# EAGLE design SSD1963_drier (EAGLE 6.1)
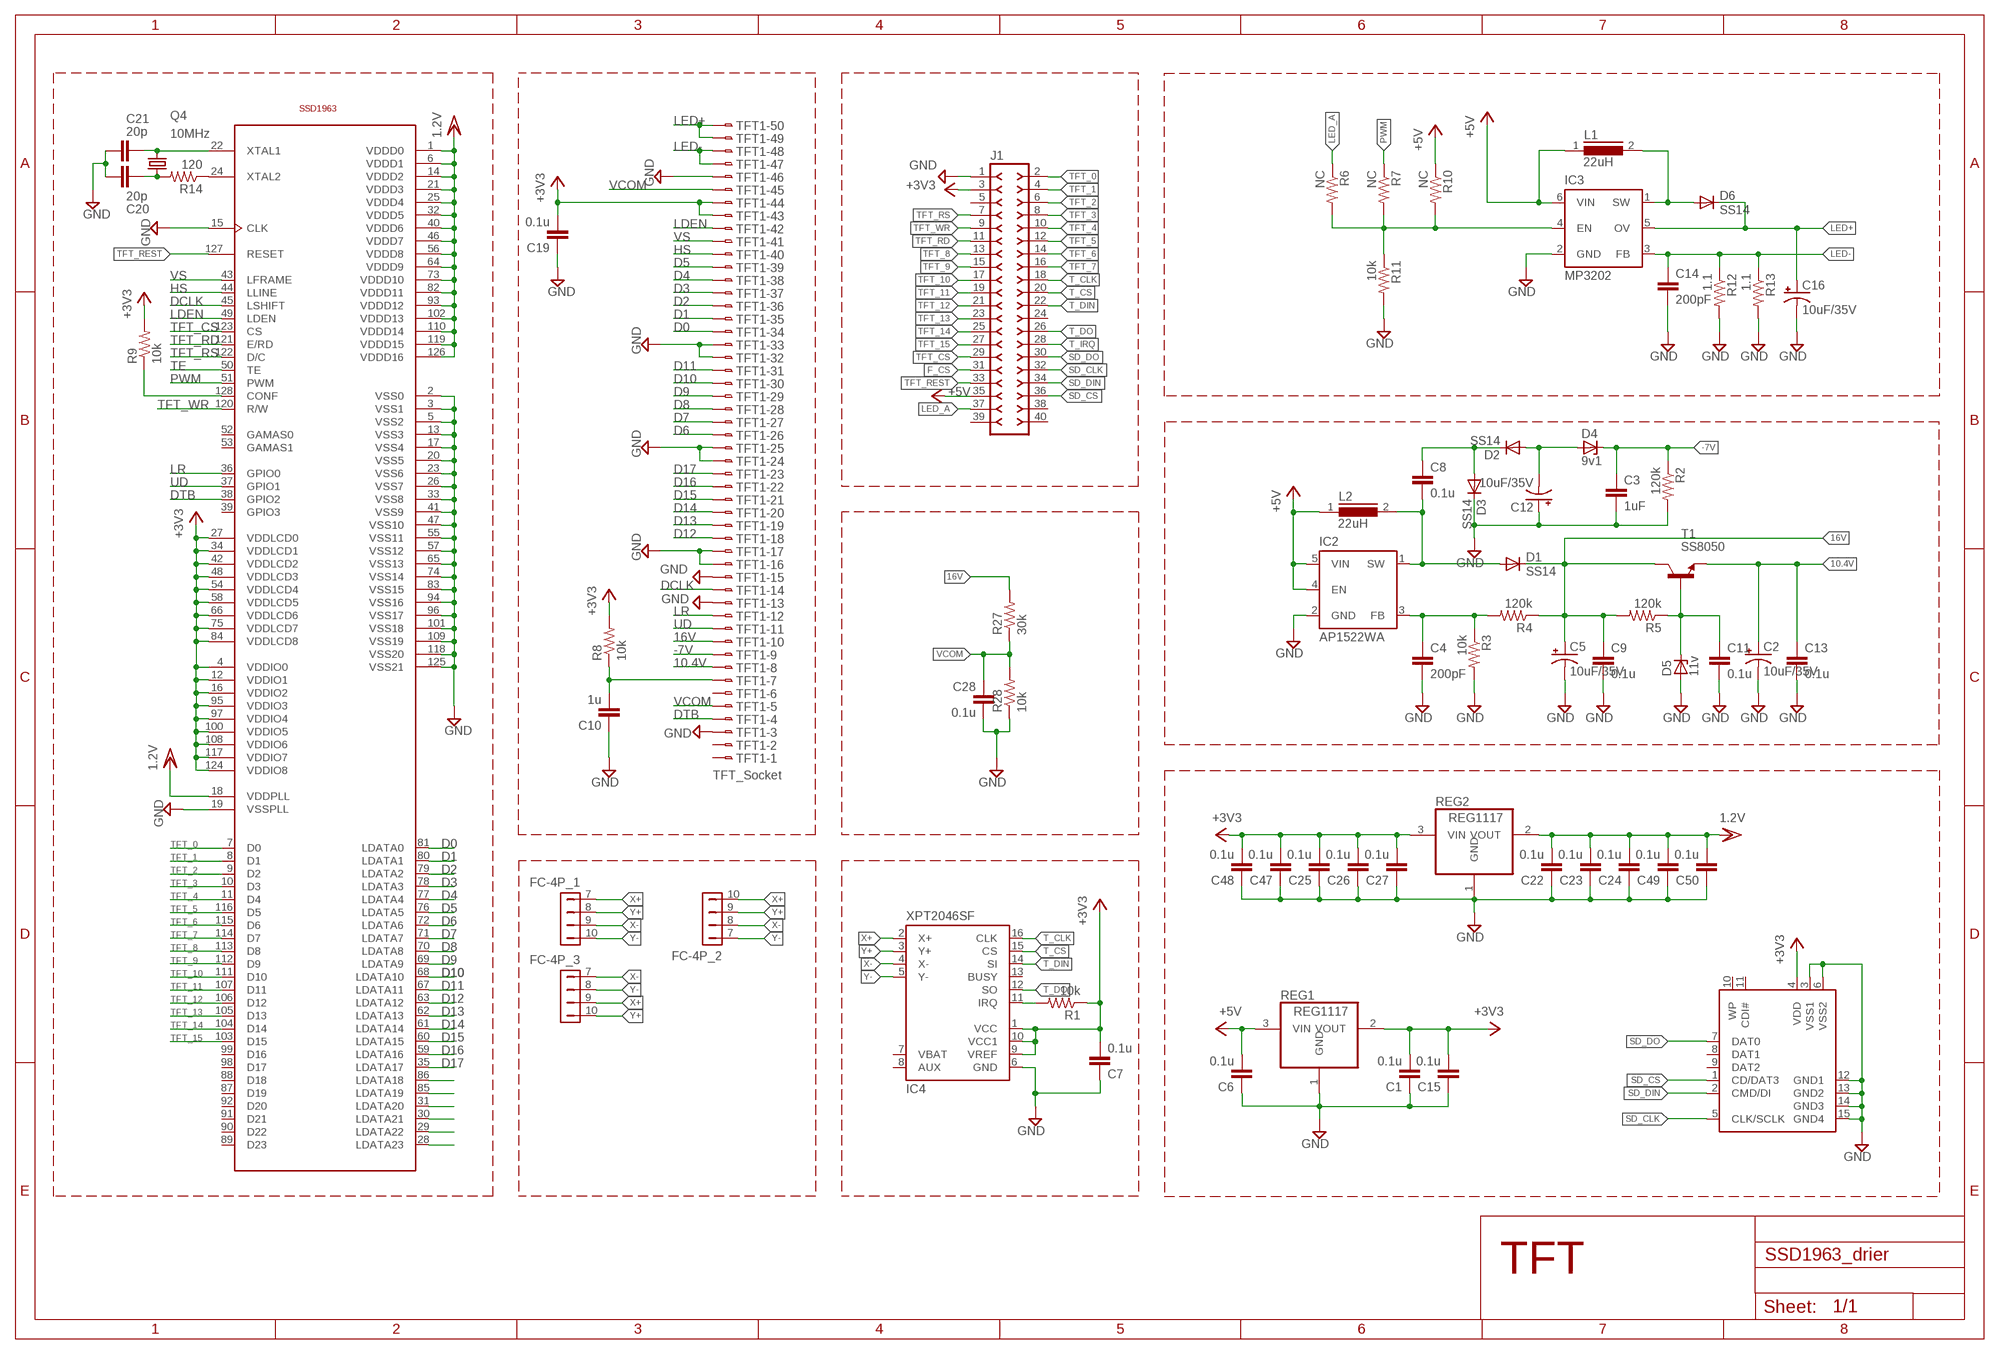
[diagram p0: schematic, sheet 1]

## Parts
C1  0.1u  C-EUC0805  [C0805]
C2  10uF/35V  CPOL-USB/3528-21R  [B/3528-21R]
C3  1uF  C-EUC0805  [C0805]
C4  200pF  C-EUC0805  [C0805]
C5  10uF/35V  CPOL-USB/3528-21R  [B/3528-21R]
C6  0.1u  C-EUC0805  [C0805]
C7  0.1u  C-EUC0805  [C0805]
C8  0.1u  C-EUC0805  [C0805]
C9  0.1u  C-EUC0805  [C0805]
C10  1u  C-EUC0805  [C0805]
C11  0.1u  C-EUC0805  [C0805]
C12  10uF/35V  CPOL-USB/3528-21R  [B/3528-21R]
C13  0.1u  C-EUC0805  [C0805]
C14  200pF  C-EUC0805  [C0805]
C15  0.1u  C-EUC0805  [C0805]
C16  10uF/35V  CPOL-USB/3528-21R  [B/3528-21R]
C19  0.1u  C-EUC0805  [C0805]
C20  20p  C-EUC0805  [C0805]
C21  20p  C-EUC0805  [C0805]
C22  0.1u  C-EUC0805  [C0805]
C23  0.1u  C-EUC0805  [C0805]
C24  0.1u  C-EUC0805  [C0805]
C25  0.1u  C-EUC0805  [C0805]
C26  0.1u  C-EUC0805  [C0805]
C27  0.1u  C-EUC0805  [C0805]
C28  0.1u  C-EUC0805  [C0805]
C47  0.1u  C-EUC0805  [C0805]
C48  0.1u  C-EUC0805  [C0805]
C49  0.1u  C-EUC0805  [C0805]
C50  0.1u  C-EUC0805  [C0805]
D1  SS14  DIODE-DO214AC  [DO214AC]
D2  SS14  DIODE-DO214AC  [DO214AC]
D3  SS14  DIODE-DO214AC  [DO214AC]
D4  9v1  ZENER-DIODESOD80C  [SOD80C]
D5  11v  ZENER-DIODESOD80C  [SOD80C]
D6  SS14  DIODE-DO214AC  [DO214AC]
FC-4P_1  FH12-04S-1S  [FH12-4S-1SH]
FC-4P_2  FH12-04S-1S  [FH12-4S-1SH]
FC-4P_3  FH12-04S-1S  [FH12-4S-1SH]
IC1  SSD1963LQFP  [LQFP128]
IC2  AP1522WA  [SOT23-5L]
IC3  MP3202  [SOT23-6L]
IC4  XPT2046SF  [TSSOP16L]
J1  F-2X20-SF-100  [SF-100-2X20]
L1  22uH  DR74  [DR74]
L2  22uH  DR74  [DR74]
Q4  10MHz  CRYSTALHC49UP  [HC49UP]
R1  10k  R-US_R0805  [R0805]
R2  120k  R-US_R0805  [R0805]
R3  10k  R-US_R0805  [R0805]
R4  120k  R-US_R0805  [R0805]
R5  120k  R-US_R0805  [R0805]
R6  NC  R-US_R0805  [R0805]
R7  NC  R-US_R0805  [R0805]
R8  10k  R-US_M0805  [M0805]
R9  10k  R-US_M0805  [M0805]
R10  NC  R-US_R0805  [R0805]
R11  10k  R-US_R0805  [R0805]
R12  1.1  R-US_R0805  [R0805]
R13  1.1  R-US_R0805  [R0805]
R14  120  R-US_M0805  [M0805]
R27  30k  R-US_M0805  [M0805]
R28  10k  R-US_M0805  [M0805]
REG1  REG1117  [SOT223]
REG2  REG1117  [SOT223]
SOC_1  MMC/SD  SDCARDVAR2  [SDCMF-10915W010]
T1  SS8050  BC847  [SOT23]
TFT1  TFT_Socket  FH28-50S-0.5SH(51)XL  [50]

## Nets
10.4V: C2.+ C13.1 T1.2(E) TFT1.8
16V: C5.+ C9.1 D1.C R4.1 R5.2 R27.2 T1.3(C) TFT1.10
+3V3: C1.2 C7.2 C15.2 C19.2 C25.2 C26.2 C27.2 C47.2 C48.2 IC1.4(VDDIO0) IC1.12(VDDIO1) IC1.16(VDDIO2) IC1.27(VDDLCD0) IC1.34(VDDLCD1) IC1.42(VDDLCD2) IC1.48(VDDLCD3) IC1.54(VDDLCD4) IC1.58(VDDLCD5) IC1.66(VDDLCD6) IC1.75(VDDLCD7) IC1.84(VDDLCD8) IC1.95(VDDIO3) IC1.97(VDDIO4) IC1.100(VDDIO5) IC1.108(VDDIO6) IC1.117(VDDIO7) IC1.124(VDDIO8) IC4.1(VCC) IC4.9(VREF) IC4.10(VCC1) J1.3 R1.1 R8.2 R9.2 REG1.2(VOUT) REG2.3(VIN) SOC_1.4(VDD) TFT1.43 TFT1.44
+5V: C6.2 IC2.4(EN) IC2.5(VIN) IC3.6(VIN) J1.35 L1.1 L2.1 R10.1 REG1.3(VIN)
-7V: C3.1 D4.C R2.1 TFT1.9
D0: IC1.81(LDATA0) TFT1.34
D1: IC1.80(LDATA1) TFT1.35
D2: IC1.79(LDATA2) TFT1.36
D3: IC1.78(LDATA3) TFT1.37
D4: IC1.77(LDATA4) TFT1.38
D5: IC1.76(LDATA5) TFT1.39
D6: IC1.72(LDATA6) TFT1.26
D7: IC1.71(LDATA7) TFT1.27
D8: IC1.70(LDATA8) TFT1.28
D9: IC1.69(LDATA9) TFT1.29
D10: IC1.68(LDATA10) TFT1.30
D11: IC1.67(LDATA11) TFT1.31
D12: IC1.63(LDATA12) TFT1.18
D13: IC1.62(LDATA13) TFT1.19
D14: IC1.61(LDATA14) TFT1.20
D15: IC1.60(LDATA15) TFT1.21
D16: IC1.59(LDATA16) TFT1.22
D17: IC1.35(LDATA17) TFT1.23
DCLK: IC1.45(LSHIFT) TFT1.14
DTB: IC1.38(GPIO2) TFT1.4
F_CS: J1.31
GND: C1.1 C2.- C3.2 C4.2 C5.- C6.1 C7.1 C9.2 C10.1 C11.2 C12.+ C13.2 C14.2 C15.1 C16.- C19.1 C20.1 C21.1 C22.1 C23.1 C24.1 C25.1 C26.1 C27.1 C28.2 C47.1 C48.1 C49.1 C50.1 D3.C D5.A IC1.2(VSS0) IC1.3(VSS1) IC1.5(VSS2) IC1.13(VSS3) IC1.15(CLK) IC1.17(VSS4) IC1.19(VSSPLL) IC1.20(VSS5) IC1.23(VSS6) IC1.26(VSS7) IC1.33(VSS8) IC1.41(VSS9) IC1.47(VSS10) IC1.55(VSS11) IC1.57(VSS12) IC1.65(VSS13) IC1.74(VSS14) IC1.83(VSS15) IC1.94(VSS16) IC1.96(VSS17) IC1.101(VSS18) IC1.109(VSS19) IC1.118(VSS20) IC1.125(VSS21) IC2.2(GND) IC3.2(GND) IC4.6(GND) J1.1 R2.2 R3.2 R11.2 R12.2 R13.2 R28.1 REG1.1(GND) REG2.1(GND) SOC_1.3(VSS1) SOC_1.6(VSS2) SOC_1.12(GND1) SOC_1.13(GND2) SOC_1.14(GND3) SOC_1.15(GND4) TFT1.3 TFT1.13 TFT1.15 TFT1.16 TFT1.17 TFT1.24 TFT1.25 TFT1.32 TFT1.33 TFT1.46
HS: IC1.44(LLINE) TFT1.40
LDEN: IC1.49(LDEN) TFT1.42
LED+: C16.+ D6.C IC3.5(OV) TFT1.49 TFT1.50
LED-: C14.1 IC3.3(FB) R12.1 R13.1 TFT1.47 TFT1.48
LED_A: J1.37 R6.1
LR: IC1.36(GPIO0) TFT1.12
N$2: C8.2 D1.A IC2.1(SW) L2.2
N$4: IC1.24(XTAL2) R14.1
N$7: C8.1 D2.C D3.A
N$8: C12.- D2.A D4.A
N$9: C4.1 IC2.3(FB) R3.1 R4.2
N$11: D6.A IC3.1(SW) L1.2
N$12: C11.1 D5.C R5.1 T1.1(B)
N$13: IC3.4(EN) R6.2 R7.2 R10.2 R11.1
N$15: C21.2 IC1.22(XTAL1) Q4.2
N$16: C20.2 Q4.1 R14.2
N$17: IC1.86(LDATA18)
N$19: IC1.85(LDATA19)
N$20: IC1.31(LDATA20)
N$21: IC1.30(LDATA21)
N$22: IC1.29(LDATA22)
N$23: IC1.28(LDATA23)
N$24: IC1.128(CONF) R9.1
N$28: C10.2 R8.1 TFT1.7
PWM: IC1.51(PWM) R7.1
SD_CLK: J1.32 SOC_1.5(CLK/SCLK)
SD_CS: J1.36 SOC_1.1(CD/DAT3)
SD_DIN: J1.34 SOC_1.2(CMD/DI)
SD_DO: J1.30 SOC_1.7(DAT0)
T_CLK: IC4.16(CLK) J1.18
T_CS: IC4.15(CS) J1.20
T_DIN: IC4.14(SI) J1.22
T_DO: IC4.12(SO) J1.26
T_IRQ: IC4.11(IRQ) J1.28 R1.2
TE: IC1.50(TE)
TFT_0: IC1.7(D0) J1.2
TFT_1: IC1.8(D1) J1.4
TFT_2: IC1.9(D2) J1.6
TFT_3: IC1.10(D3) J1.8
TFT_4: IC1.11(D4) J1.10
TFT_5: IC1.116(D5) J1.12
TFT_6: IC1.115(D6) J1.14
TFT_7: IC1.114(D7) J1.16
TFT_8: IC1.113(D8) J1.13
TFT_9: IC1.112(D9) J1.15
TFT_10: IC1.111(D10) J1.17
TFT_11: IC1.107(D11) J1.19
TFT_12: IC1.106(D12) J1.21
TFT_13: IC1.105(D13) J1.23
TFT_14: IC1.104(D14) J1.25
TFT_15: IC1.103(D15) J1.27
TFT_CS: IC1.123(CS) J1.29
TFT_RD: IC1.121(E/RD) J1.11
TFT_REST: IC1.127(RESET) J1.33
TFT_RS: IC1.122(D/C) J1.7
TFT_WR: IC1.120(R/W) J1.9
UD: IC1.37(GPIO1) TFT1.11
VCC/2: C22.2 C23.2 C24.2 C49.2 C50.2 IC1.1(VDDD0) IC1.6(VDDD1) IC1.14(VDDD2) IC1.18(VDDPLL) IC1.21(VDDD3) IC1.25(VDDD4) IC1.32(VDDD5) IC1.40(VDDD6) IC1.46(VDDD7) IC1.56(VDDD8) IC1.64(VDDD9) IC1.73(VDDD10) IC1.82(VDDD11) IC1.93(VDDD12) IC1.102(VDDD13) IC1.110(VDDD14) IC1.119(VDDD15) IC1.126(VDDD16) REG2.2(VOUT) ; supply symbol labelled 1.2V
VCOM: C28.1 R27.1 R28.2 TFT1.5 TFT1.45
VS: IC1.43(LFRAME) TFT1.41
X+: FC-4P_1.7 FC-4P_2.10 FC-4P_3.9 IC4.2(X+)
X-: FC-4P_1.9 FC-4P_2.8 FC-4P_3.7 IC4.4(X-)
Y+: FC-4P_1.8 FC-4P_2.9 FC-4P_3.10 IC4.3(Y+)
Y-: FC-4P_1.10 FC-4P_2.7 FC-4P_3.8 IC4.5(Y-)
Unconnected: IC1.39(GPIO3) IC1.52(GAMAS0) IC1.53(GAMAS1) IC1.87(D19) IC1.88(D18) IC1.89(D23) IC1.90(D22) IC1.91(D21) IC1.92(D20) IC1.98(D17) IC1.99(D16) IC4.7(VBAT) IC4.8(AUX) IC4.13(BUSY) J1.5 J1.24 J1.38 J1.39 J1.40 SOC_1.8(DAT1) SOC_1.9(DAT2) SOC_1.10(WP) SOC_1.11(CDI#) TFT1.1 TFT1.2 TFT1.6

## Notes on the sheet
- TFT

## Library data of the parts
C1 C3 C4 C6-C11 C13-C15 C19-C28 C47-C50 = rcl:C-EU: CAPACITOR, European symbol
C2 C5 C12 C16 = rcl:CPOL-US: POLARIZED CAPACITOR, American symbol
D1-D3 D6 = diode:DIODE-: DIODE
D4 D5 = diode:ZENER-DIODE: Z-Diode
FC-4P_1-FC-4P_3 = con-hirose:FH12-04S-1S
IC1 = 2ref-packages-longpad:SSD1963
IC2 = 2ref-packages-longpad:AP1522WA
IC3 = 2ref-packages-longpad:MP3202
IC4 = 2ref-packages-longpad:XPT2046
J1 = con-headers-jp:F-2X20-: FEMALE HEADER
L1 L2 = inductors:DR74: High Power Density, High Efficiency, Shielded Inductors Source: coiltronics_dr_series.pdf
Q4 = crystal:CRYSTAL: CRYSTAL; OC_FARNELL: unknown; OC_NEWARK: unknown
R1-R7 R10-R13 = rcl:R-US_: RESISTOR, American symbol
R8 R9 R14 R27 R28 = resistor:R-US_: RESISTOR, American symbol
REG1 REG2 = burr-brown:REG1117: 800mA and 1A Low Dropout (LDO) Positive Regulator 1.8V, 2.5V, 2.85V, 3.3V, 5V, and Adj; MPN: REG1117; OC_FARNELL: 1097566; OC_NEWARK: 14P6981
SOC_1 = kingfont_sdcmf10915w010_covek:SDCARD: SD card connector KINGFONT SDCMF-10915W010
T1 = transistor:BC847: NPN TRANSISTOR
TFT1 = con-hirose:FH28-50S-0.5SH(51): Flexible Printed Circuit & Flexible Flat Cable ZIF Connectors 0.5 mm Pitch, 2.55 mm above the board Source: http://www.hirose.co.jp/cataloge_hp/e58618038.pdf

## Board
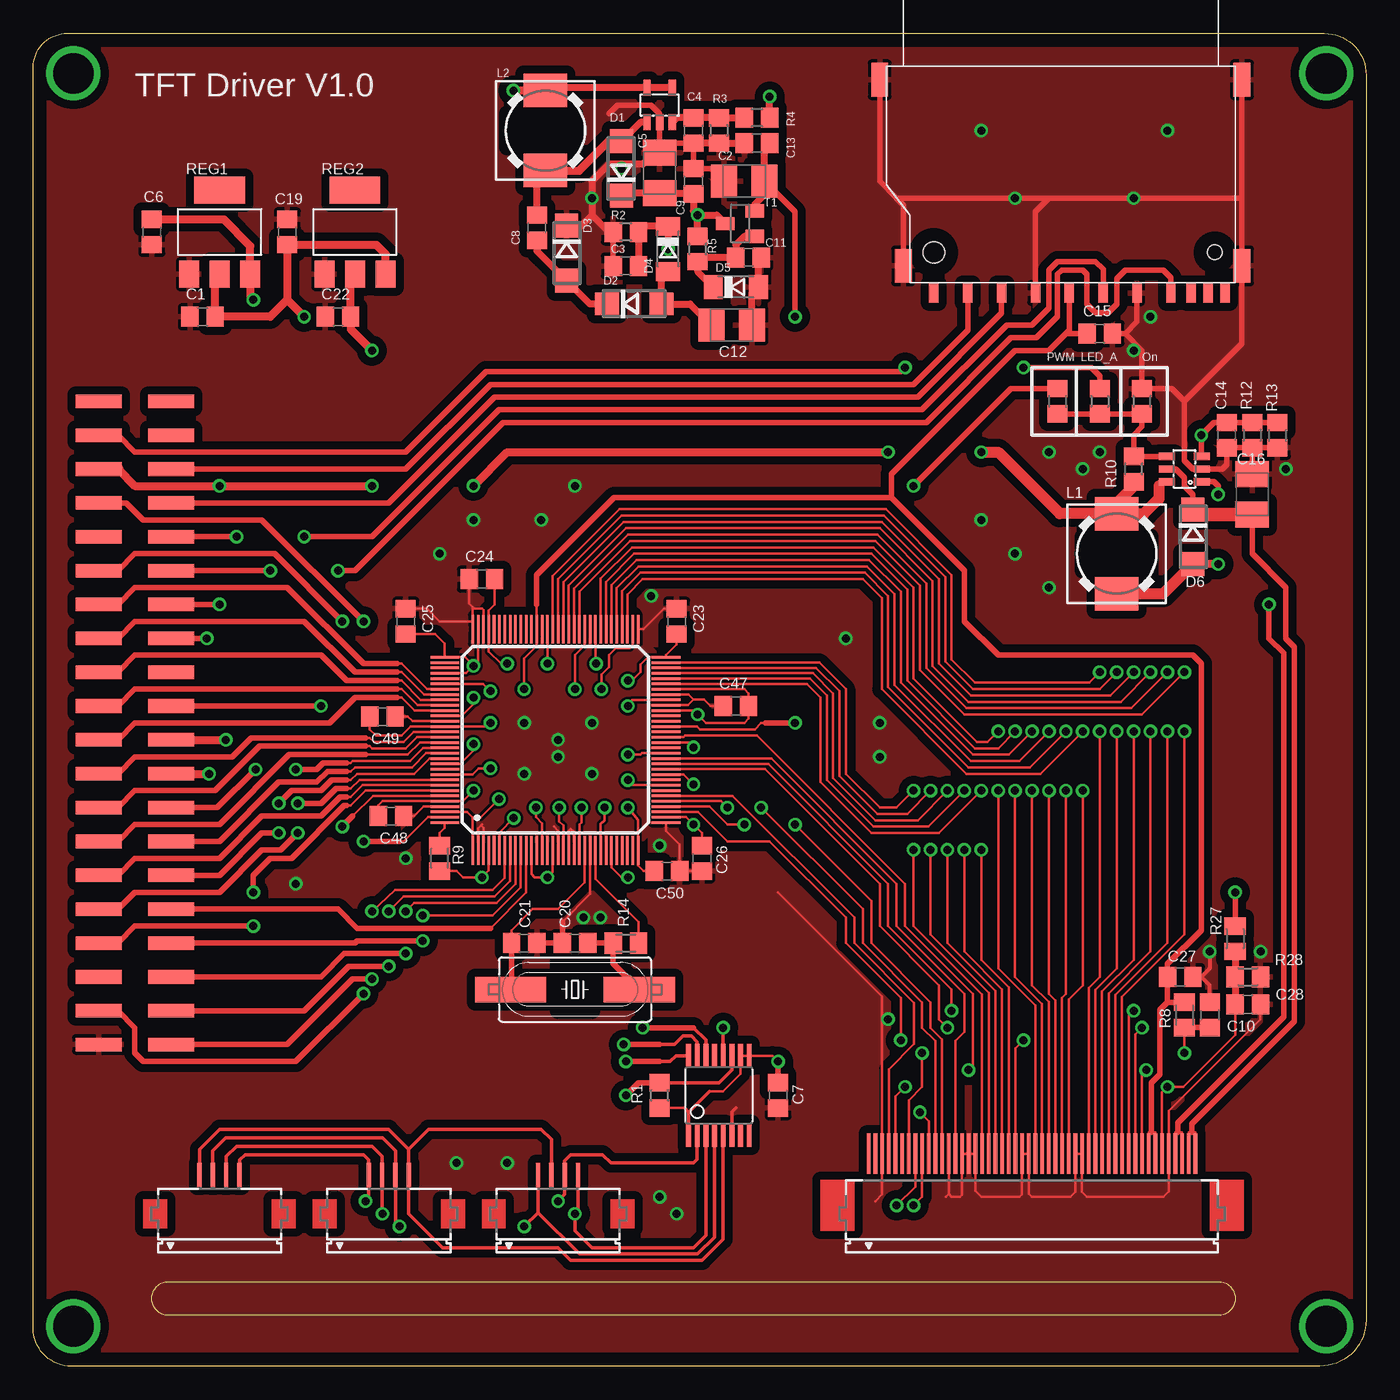
[diagram p1: board, top side]
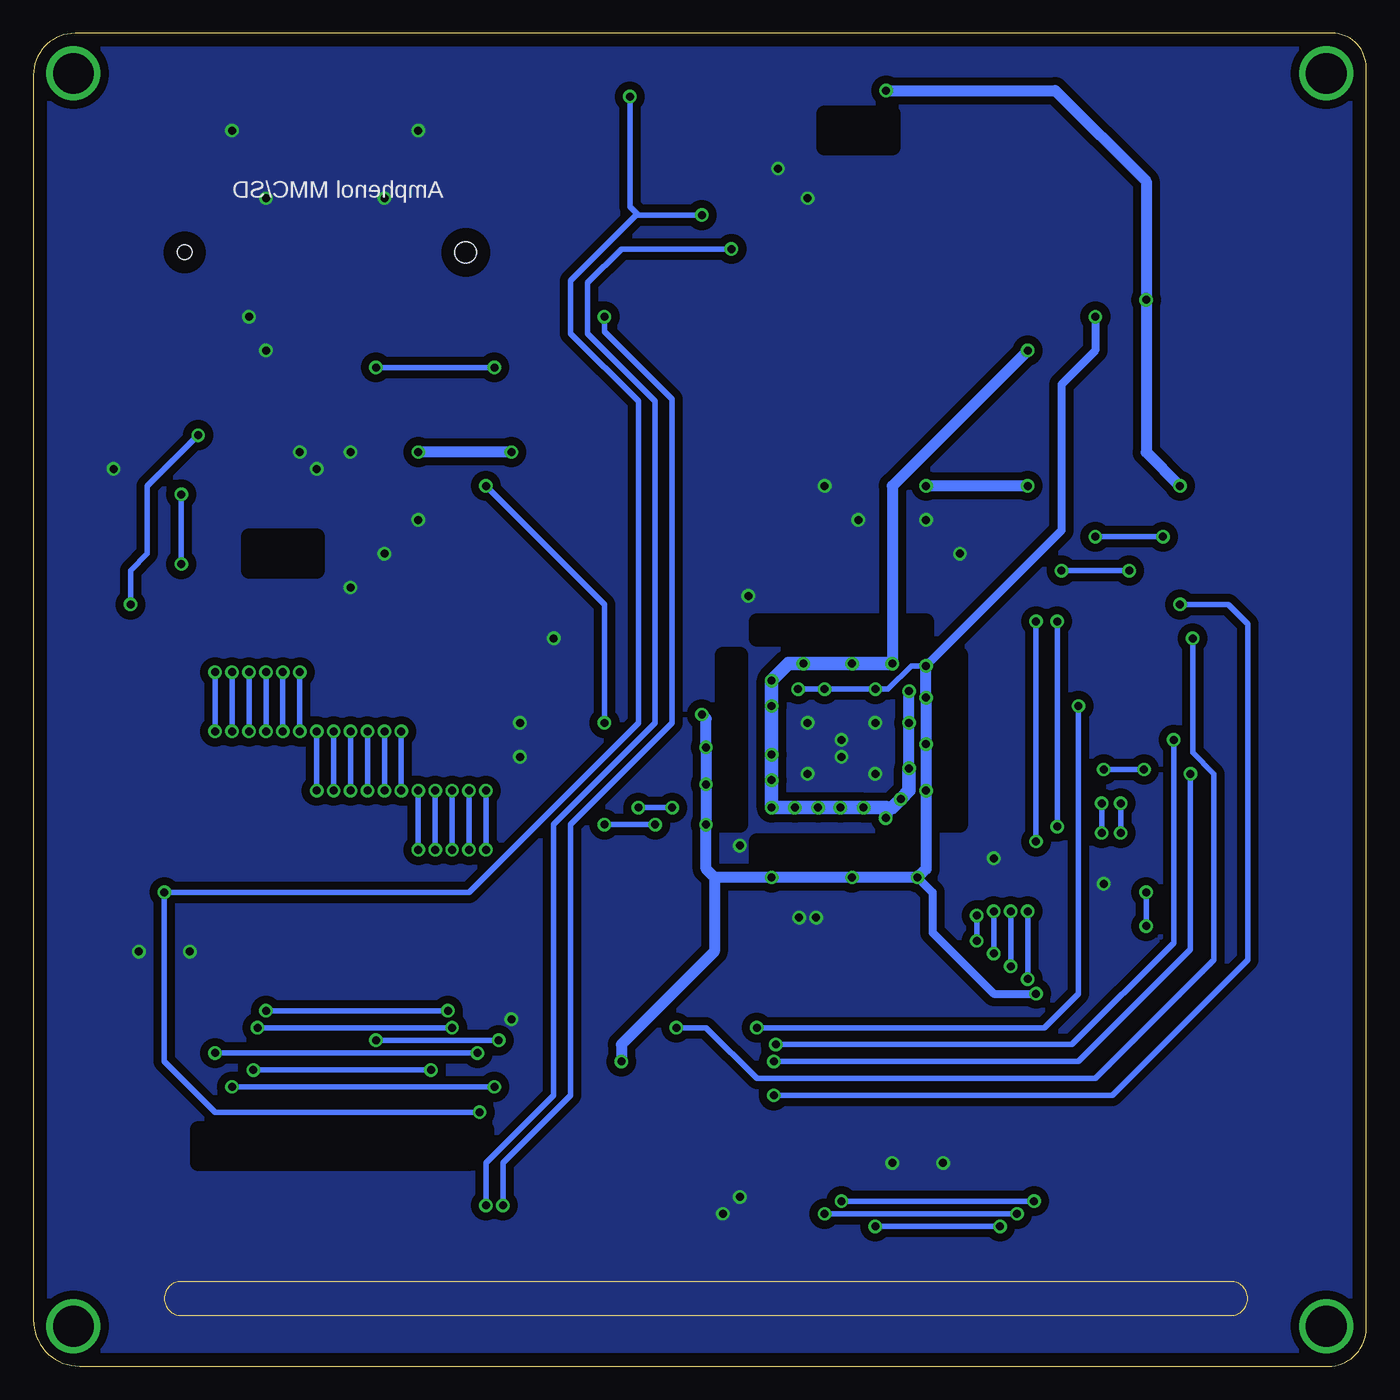
[diagram p2: board, bottom side, seen from below]

Size 100 x 100 mm. Coordinates in mm from the lower left corner, seen from the top.
Outline: 100,96.88 100,3.48 arc-90 96.52,0 2.84,0 arc-90 0,2.84 0,97.45 arc-90 2.55,100 96.88,100 arc-90 100,96.88
Copper layers (1*16): Top 0.035mm / dielectric 1.5mm / Bottom 0.035mm
Design rules: minimum track width 6mil, minimum drill 0.6mm, track to track 6mil, track to pad 6mil, pad to pad 6mil, via to via 6mil, smd to smd 6mil, copper to edge 40mil, drill to drill 8mil, minimum pad ring 10mil, minimum via ring 8mil, stop-mask expansion 2mil, vias tented up to drill 0.8mm, thermal gap 10mil
tRestrict: area 39.4,26.7 to 41.9,30.5; area 78.7,59.7 to 83.8,62.2; area 35.6,91.4 to 40.6,94
bRestrict: area 78.7,59.7 to 83.8,62.2; area 35.6,91.4 to 40.6,94; area 47,40.6 to 48.3,53.3; area 30.5,40.6 to 31.8,53.3; area 34.3,38.1 to 45.7,39.4; area 36.8,54.6 to 45.7,55.9; area 33,54.6 to 34.3,55.9; area 67.3,15.2 to 87.6,17.8; area 66,16.5 to 67.3,17.8
Milling: 4 lines

### Footprints (pad centres in the part's own frame; a part is rotated, then mirrored left to right if it is on the bottom)
C0805 = smd 1.3 x 1.5: 1 -0.95,0; 2 0.95,0
B/3528-21R = smd 1.95 x 2.5: + 1.525,0; - -1.525,0
DO214AC = smd 1.8 x 1.7: A 2.05,0; C -2.05,0
SOD80C = smd 1.4 x 1.8: A 1.7,0; C -1.7,0
FH12-4S-1SH = smd 0.318 x 1.778: 7 -1.5,2.933; 8 -0.5,2.933; 9 0.5,2.933; 10 1.5,2.933
LQFP128 = smd 2.159 x 0.19: 1 -8.3,6.4; 2 -8.3,6; 3 -8.3,5.6; 4 -8.3,5.2; 5 -8.3,4.8; 6 -8.3,4.4; 7 -8.3,4; 8 -8.3,3.6; 9 -8.3,3.2; 10 -8.3,2.8; 11 -8.3,2.4; 12 -8.3,2; 13 -8.3,1.6; 14 -8.3,1.2; 15 -8.3,0.8; 16 -8.3,0.4; 17 -8.3,0; 18 -8.3,-0.4; 19 -8.3,-0.8; 20 -8.3,-1.2; 21 -8.3,-1.6; 22 -8.3,-2; 23 -8.3,-2.4; 24 -8.3,-2.8; 25 -8.3,-3.2; 26 -8.3,-3.6; 27 -8.3,-4; 28 -8.3,-4.4; 29 -8.3,-4.8; 30 -8.3,-5.2; 31 -8.3,-5.6; 32 -8.3,-6; 65 8.3,-6; 66 8.3,-5.6; 67 8.3,-5.2; 68 8.3,-4.8; 69 8.3,-4.4; 70 8.3,-4; 71 8.3,-3.6; 72 8.3,-3.2; 73 8.3,-2.8; 74 8.3,-2.4; 75 8.3,-2; 76 8.3,-1.6; 77 8.3,-1.2; 78 8.3,-0.8; 79 8.3,-0.4; 80 8.3,0; 81 8.3,0.4; 82 8.3,0.8; 83 8.3,1.2; 84 8.3,1.6; 85 8.3,2; 86 8.3,2.4; 87 8.3,2.8; 88 8.3,3.2; 89 8.3,3.6; 90 8.3,4; 91 8.3,4.4; 92 8.3,4.8; 93 8.3,5.2; 94 8.3,5.6; 95 8.3,6; 96 8.3,6.4 | smd 0.19 x 2.159: 33 -6.2,-8.1; 34 -5.8,-8.1; 35 -5.4,-8.1; 36 -5,-8.1; 37 -4.6,-8.1; 38 -4.2,-8.1; 39 -3.8,-8.1; 40 -3.4,-8.1; 41 -3,-8.1; 42 -2.6,-8.1; 43 -2.2,-8.1; 44 -1.8,-8.1; 45 -1.4,-8.1; 46 -1,-8.1; 47 -0.6,-8.1; 48 -0.2,-8.1; 49 0.2,-8.1; 50 0.6,-8.1; 51 1,-8.1; 52 1.4,-8.1; 53 1.8,-8.1; 54 2.2,-8.1; 55 2.6,-8.1; 56 3,-8.1; 57 3.4,-8.1; 58 3.8,-8.1; 59 4.2,-8.1; 60 4.6,-8.1; 61 5,-8.1; 62 5.4,-8.1; 63 5.8,-8.1; 64 6.2,-8.1; 97 6.2,8.5; 98 5.8,8.5; 99 5.4,8.5; 100 5,8.5; 101 4.6,8.5; 102 4.2,8.5; 103 3.8,8.5; 104 3.4,8.5; 105 3,8.5; 106 2.6,8.5; 107 2.2,8.5; 108 1.8,8.5; 109 1.4,8.5; 110 1,8.5; 111 0.6,8.5; 112 0.2,8.5; 113 -0.2,8.5; 114 -0.6,8.5; 115 -1,8.5; 116 -1.4,8.5; 117 -1.8,8.5; 118 -2.2,8.5; 119 -2.6,8.5; 120 -3,8.5; 121 -3.4,8.5; 122 -3.8,8.5; 123 -4.2,8.5; 124 -4.6,8.5; 125 -5,8.5; 126 -5.4,8.5; 127 -5.8,8.5; 128 -6.2,8.5
SOT23-5L = smd 0.55 x 1.2: 1 -0.95,-1.3; 2 0,-1.3; 3 0.95,-1.3; 4 0.95,1.3; 5 -0.95,1.3
SOT23-6L = smd 0.55 x 1.2: 1 -0.95,-1.3; 2 0,-1.3; 3 0.95,-1.3; 4 0.95,1.3; 5 0,1.3; 6 -0.95,1.3
TSSOP16L = smd 0.368 x 1.778: 1 -2.275,-2.97; 2 -1.625,-2.97; 3 -0.975,-2.97; 4 -0.325,-2.97; 5 0.325,-2.97; 6 0.975,-2.97; 7 1.625,-2.97; 8 2.275,-2.97; 9 2.275,2.97; 10 1.625,2.97; 11 0.975,2.97; 12 0.325,2.97; 13 -0.325,2.97; 14 -0.975,2.97; 15 -1.625,2.97; 16 -2.275,2.97
SF-100-2X20 = smd 1.02 x 3.45: 1 -24.13,2.725; 2 -24.13,-2.725; 3 -21.59,2.725; 4 -21.59,-2.725; 5 -19.05,2.725; 6 -19.05,-2.725; 7 -16.51,2.725; 8 -16.51,-2.725; 9 -13.97,2.725; 10 -13.97,-2.725; 11 -11.43,2.725; 12 -11.43,-2.725; 13 -8.89,2.725; 14 -8.89,-2.725; 15 -6.35,2.725; 16 -6.35,-2.725; 17 -3.81,2.725; 18 -3.81,-2.725; 19 -1.27,2.725; 20 -1.27,-2.725; 21 1.27,2.725; 22 1.27,-2.725; 23 3.81,2.725; 24 3.81,-2.725; 25 6.35,2.725; 26 6.35,-2.725; 27 8.89,2.725; 28 8.89,-2.725; 29 11.43,2.725; 30 11.43,-2.725; 31 13.97,2.725; 32 13.97,-2.725; 33 16.51,2.725; 34 16.51,-2.725; 35 19.05,2.725; 36 19.05,-2.725; 37 21.59,2.725; 38 21.59,-2.725; 39 24.13,2.725; 40 24.13,-2.725
DR74 = smd 2.5 x 3.25: 1 -3,0; 2 3,0
HC49UP = smd 5.334 x 1.93: 1 -4.826,0; 2 4.826,0
R0805 = smd 1.3 x 1.5: 1 -0.95,0; 2 0.95,0
M0805 = smd 1.3 x 1.6: 1 -0.95,0; 2 0.95,0
SOT223 = smd 1.499 x 2.007: 1 -2.261,-3.15; 2 0.025,-3.15; 3 2.311,-3.15 | smd 3.81 x 2.007: 4 0,3.15
SDCMF-10915W010 = smd 0.711 x 1.422: 1 7.366,13.462; 2 4.826,13.462; 3 2.286,13.462; 4 -0.254,13.462; 5 -2.794,13.462; 6 -5.334,13.462; 7 -7.874,13.462; 8 -9.398,13.462; 9 9.906,13.462; 10 -11.938,13.462; 11 -10.668,13.462 | smd 1.27 x 2.54: 12 12.192,11.43; 13 13.97,-2.54; 14 -13.208,-2.54; 15 -13.208,11.43 | hole 1.6: 9.906,10.414 | hole 1.1: -11.176,10.414
SOT23 = smd 1 x 1.4: 1 -0.95,-1.1; 2 0.95,-1.1; 3 0,1.1
50 = smd 0.267 x 3.048: 1 -12.25,4.52; 2 -11.75,4.52; 3 -11.25,4.52; 4 -10.75,4.52; 5 -10.25,4.52; 6 -9.75,4.52; 7 -9.25,4.52; 8 -8.75,4.52; 9 -8.25,4.52; 10 -7.75,4.52; 11 -7.25,4.52; 12 -6.75,4.52; 13 -6.25,4.52; 14 -5.75,4.52; 15 -5.25,4.52; 16 -4.75,4.52; 17 -4.25,4.52; 18 -3.75,4.52; 19 -3.25,4.52; 20 -2.75,4.52; 21 -2.25,4.52; 22 -1.75,4.52; 23 -1.25,4.52; 24 -0.75,4.52; 25 -0.25,4.52; 26 0.25,4.52; 27 0.75,4.52; 28 1.25,4.52; 29 1.75,4.52; 30 2.25,4.52; 31 2.75,4.52; 32 3.25,4.52; 33 3.75,4.52; 34 4.25,4.52; 35 4.75,4.52; 36 5.25,4.52; 37 5.75,4.52; 38 6.25,4.52; 39 6.75,4.52; 40 7.25,4.52; 41 7.75,4.52; 42 8.25,4.52; 43 8.75,4.52; 44 9.25,4.52; 45 9.75,4.52; 46 10.25,4.52; 47 10.75,4.52; 48 11.25,4.52; 49 11.75,4.52; 50 12.25,4.52

### Placement (x,y rotation side)
C1  12.7,78.74 0 top
C2  53.34,88.9 0 top
C3  44.45,82.55 180 top
C4  49.53,92.71 270 top
C5  46.99,89.53 270 top
C6  8.89,85.09 90 top
C7  55.88,20.32 90 top
C8  37.78,85.41 90 top
C9  49.53,88.9 90 top
C10  88.27,26.35 270 top
C11  53.66,83.19 0 top
C12  52.39,78.11 0 top
C13  54.29,91.76 180 top
C14  89.53,69.85 270 top
C15  80.01,77.47 180 top
C16  91.44,65.41 270 top
C19  19.05,85.09 270 top
C20  40.64,31.75 0 top
C21  36.83,31.75 180 top
C22  22.86,78.74 0 top
C23  48.26,55.88 270 top
C24  33.66,59.05 0 top
C25  27.94,55.88 270 top
C26  50.16,38.1 90 top
C27  86.04,29.21 180 top
C28  91.12,27.15 0 top
C47  52.7,49.53 0 top
C48  26.83,41.27 180 top
C49  26.19,48.74 180 top
C50  47.55,37.15 180 top
D1  44.13,89.85 90 top
D2  45.09,79.69 0 top
D3  40.01,83.5 270 top
D4  47.62,83.82 270 top
D5  52.7,80.96 0 top
D6  87,62.23 270 top
FC-4P_1  26.67,11.43 0 top
FC-4P_2  13.97,11.43 0 top
FC-4P_3  39.37,11.43 0 top
IC1  39.37,46.99 90 top
IC2  46.99,94.61 0 top
IC3  86.36,67.31 90 top
IC4  51.44,20.32 0 top
J1  7.62,48.26 90 top
L1  81.28,60.96 270 top
L2  38.42,92.71 270 top
Q4  40.64,28.26 180 top
R1  46.99,20.32 90 top
R2  44.45,85.09 180 top
R3  51.44,92.71 270 top
R4  54.29,93.66 180 top
R5  49.85,83.82 90 top
R6  80.01,72.39 270 top
R7  76.83,72.39 270 top
R8  86.36,26.35 90 top
R9  30.48,38.1 270 top
R10  82.55,67.31 90 top
R11  83.19,72.39 90 top
R12  91.44,69.85 270 top
R13  93.34,69.85 270 top
R14  44.45,31.75 180 top
R27  90.17,32.07 90 top
R28  91.12,29.21 180 top
REG1  13.97,85.09 0 top
REG2  24.13,85.09 0 top
SOC_1  77.47,93.98 180 top
T1  53.02,85.72 90 top
TFT1  74.93,11.43 0 top

### Tracks (layer width: path | path; a pad name or v marks a point on that pad's centre or on a via)
10.4V  (via drill 0.6)
  Top 0.191: TFT1.8 66.18,13.47 v64.77,12.06
  Top 0.406: v57.15,78.74 57.15,86.61 C2.+
  Top 0.508: T1.2 54.12,87.14 54.87,87.89 C2.+ 54.87,91.38 C13.1
  Bottom 0.406: v64.77,12.06 64.77,15.24 59.69,20.32 59.69,40.64 52.07,48.26 52.07,72.55 57.15,77.63 v57.15,78.74
16V  (via drill 0.6)
  Top 0.191: TFT1.10 67.18,18.39 v66.52,19.05
  Top 0.406: R27.2 v90.17,35.56
  Top 0.508: D1.C 44.34,88.01 C5.+ 47.05,87.95 C9.1 49.53,86.68 v49.85,86.36 | R5.2 v49.85,86.36 | R4.1 v55.24,95.25 | v49.85,86.36 51.29,86.36 T1.3
  Bottom 0.406: v66.52,19.05 86.36,19.05 90.17,22.86 v90.17,35.56 67.31,35.56 54.61,48.26 54.61,72.39 59.69,77.47 59.69,81.44 54.77,86.36 54.61,86.36 | v49.85,86.36 54.61,86.36 | v55.24,95.25 55.24,87 54.61,86.36
+3V3  (via drill 0.6)
  Top 0.191: TFT1.43 83.68,17.54 83.9,17.54 84.18,17.54 TFT1.44 | C25.2 30.16,54.93 30.87,54.22 IC1.97 32.38,53.19 v33.02,52.55 | 37.77,57.14 IC1.84 37.77,54.04 36.82,53.09 v36.82,50.8 | IC1.58 53.35,50.79 53.66,50.48 C47.2 53.66,48.58 53.34,48.26 50.48,48.26 v49.85,48.9 49.55,49.19 IC1.54 | IC1.27 43.37,37.43 44.13,36.67 v44.61,36.67 | IC1.48 49.17,46.79 v49.53,46.43 | IC1.34 48.98,41.19 v49.53,40.64 50.16,40.01 C26.2 | IC1.42 48.8,44.39 v49.53,43.66 | IC1.16 38.97,37.07 v38.58,36.67 37.62,36.67 37.37,36.92 IC1.12 | IC1.4 34.17,37.19 v33.66,36.67 32.23,36.67 31.75,37.15 R9.2 | IC1.117 32.01,45.19 33.02,46.2 v33.02,46.67 | IC1.108 32.12,48.79 33.02,49.69 v33.02,50.16 | v33.02,43.18 32.23,42.39 IC1.124 26.2,42.39 25.88,42.07 C48.2 | IC1.95 33.37,52.9 v33.02,52.55 | IC1.100 32.46,51.99 v33.02,52.55 | v40.64,50.8 40.64,53.34 41.37,54.07 IC1.75 | v42.62,50.8 42.62,51.91 43.18,52.47 43.18,53.34 43.74,53.9 44.77,53.9 44.97,54.1 IC1.66 | R1.1 48.84,19.37 | 50.75,20.64 51.75,20.64 53.06,21.95 IC4.10 IC4.9 55.45,23.29 v55.88,22.86
  Top 0.254: IC4.1 49.16,19.05 | 48.84,19.37 49.16,19.05 | 50.75,20.64 49.16,19.05
  Top 0.406: 83.9,17.54 83.9,21.27 84.53,21.91 84.53,26.74 85.09,27.3 | 85.09,27.62 C27.2 85.09,30.16 87.63,32.7 87.63,52.7 87,53.34 72.39,53.34 69.85,55.88 69.85,59.69 64.37,65.17 | 85.09,27.62 | R8.2 85.09,27.3 | 85.09,27.3 85.09,27.62 | 64.37,65.17 43.58,65.17 37.77,59.36 37.77,57.14 | SOC_1.4 77.72,77.72 77.47,77.47 | 64.37,65.17 64.37,66.91 73.66,76.2 76.2,76.2 77.47,77.47 | C15.2 77.47,77.47 | v55.88,22.86 C7.2 | v24.77,27.94 19.68,22.86 8.26,22.86 7.62,23.5 7.62,25.4 6.35,26.67 J1.3
  Top 0.61: REG1.2 13.65,81.59 C1.2 17.78,78.74 19.05,80.01 | REG2.3 26.44,83.41 25.72,84.14 C19.2 19.05,80.01 | 19.05,80.01 v20.32,78.74
  Bottom 0.406: v42.62,50.8 v40.64,50.8 v36.82,50.8 35.88,50.8 34.13,52.55 v33.02,52.55
  Bottom 0.61: v33.66,36.67 32.54,35.56 32.54,32.54 27.94,27.94 v24.77,27.94 | v20.32,78.74 20.32,76.2 22.86,73.66 22.86,62.71 v33.02,52.55
  Bottom 0.813: 48.9,36.67 v44.61,36.67 v38.58,36.67 v33.66,36.67 33.02,37.31 v33.02,43.18 v33.02,46.67 v33.02,50.16 v33.02,52.55 | 48.9,36.67 49.53,37.31 v49.53,40.64 v49.53,43.66 v49.53,46.43 49.53,48.58 v49.85,48.9 | 48.9,36.67 48.9,31.11 55.88,24.13 v55.88,22.86
+5V  (via drill 0.6)
  Top 0.406: IC3.6 84.78,66.36 84.45,66.04
  Top 0.508: IC2.4 IC2.5 38.62,95.92 L2.1
  Top 0.61: 6.35,67.31 7.62,66.04 v13.97,66.04 v25.4,66.04 | v33.02,66.04 35.56,68.58 v64.14,68.58 | v16.51,80.01 16.28,80.24 REG1.3 16.28,84.05 14.29,86.04 C6.2 | L2.1 v36.02,95.71
  Top 0.813: J1.35 6.35,67.31 | v71.12,68.58 72.39,68.58 77.01,63.96 L1.1 | L1.1 83.33,63.96 84.45,65.09 84.45,66.04 | R10.1 82.55,66.04 81.28,64.77 L1.1
  Bottom 0.813: v64.14,68.58 v71.12,68.58 | v25.4,66.04 v33.02,66.04 | v13.97,66.04 16.51,68.58 v16.51,80.01 16.51,88.9 23.32,95.71 v36.02,95.71
-7V  (via drill 0.6)
  Top 0.191: TFT1.9 66.68,12.71 v66.04,12.06
  Top 0.508: C3.1 R2.1 45.83,85.52 D4.C v47.62,83.82
  Bottom 0.406: v47.62,83.82 55.88,83.82 58.42,81.28 58.42,77.47 53.34,72.39 53.34,48.26 60.96,40.64 60.96,20.32 66.04,15.24 v66.04,12.06
D0  (via drill 0.6)
  Top 0.191: v80.01,52.07 79.22,51.28 70.64,51.28 68.9,53.02 68.9,59.37 63.98,64.29 43.97,64.29 38.97,59.29 IC1.81 | TFT1.34 79.18,28.38 80.01,29.21 v80.01,47.62
  Bottom 0.406: v80.01,52.07 v80.01,47.62
D1  (via drill 0.6)
  Top 0.191: v81.28,52.07 80.01,50.8 70.48,50.8 68.42,52.86 68.42,59.21 63.82,63.82 44.13,63.82 39.37,59.05 IC1.80 | TFT1.35 79.68,28.25 81.28,29.84 v81.28,47.62
  Bottom 0.406: v81.28,52.07 v81.28,47.62
D2  (via drill 0.6)
  Top 0.191: v82.55,52.07 80.8,50.32 70.33,50.32 67.94,52.7 67.94,59.05 63.66,63.34 44.29,63.34 39.77,58.82 IC1.79 | v82.55,47.62 82.55,30.48 80.18,28.11 TFT1.36
  Bottom 0.406: v82.55,52.07 v82.55,47.62
D3  (via drill 0.6)
  Top 0.191: v83.82,52.07 81.6,49.85 70.17,49.85 67.47,52.55 67.47,58.9 63.5,62.87 44.45,62.87 40.17,58.59 IC1.78 | v83.82,47.62 83.82,31.11 80.68,27.98 TFT1.37
  Bottom 0.406: v83.82,52.07 v83.82,47.62
D4  (via drill 0.6)
  Top 0.191: v85.09,52.07 82.39,49.37 70.01,49.37 66.99,52.39 66.99,58.74 63.34,62.39 44.61,62.39 40.57,58.35 IC1.77 | v85.09,47.62 85.09,31.75 81.18,27.84 TFT1.38
  Bottom 0.406: v85.09,52.07 v85.09,47.62
D5  (via drill 0.6)
  Top 0.191: v86.36,52.07 83.19,48.9 69.85,48.9 66.52,52.23 66.52,58.58 63.18,61.91 44.77,61.91 40.97,58.12 IC1.76 | v86.36,47.62 86.36,32.38 81.68,27.7 TFT1.39
  Bottom 0.406: v86.36,52.07 v86.36,47.62
D6  (via drill 0.6)
  Top 0.191: IC1.72 42.57,59.08 44.93,61.44 63.02,61.44 66.04,58.42 66.04,51.59 70.8,46.83 71.6,46.83 v72.39,47.62 | v72.39,43.18 72.39,29.84 75.18,27.05 TFT1.26
  Bottom 0.406: v72.39,47.62 v72.39,43.18
D7  (via drill 0.6)
  Top 0.191: IC1.71 42.97,58.84 45.09,60.96 62.87,60.96 65.56,58.26 65.56,51.44 70.64,46.35 72.39,46.35 v73.66,47.62 | v73.66,43.18 73.66,29.21 75.68,27.19 TFT1.27
  Bottom 0.406: v73.66,47.62 v73.66,43.18
D8  (via drill 0.6)
  Top 0.191: IC1.70 43.37,58.61 45.24,60.48 62.71,60.48 65.09,58.1 65.09,51.28 70.48,45.88 73.18,45.88 v74.93,47.62 | v74.93,43.18 74.93,28.57 76.18,27.32 TFT1.28
  Bottom 0.406: v74.93,47.62 v74.93,43.18
D9  (via drill 0.6)
  Top 0.191: IC1.69 43.77,58.38 45.4,60.01 62.55,60.01 64.61,57.94 64.61,51.12 70.33,45.4 73.98,45.4 v76.2,47.62 | v76.2,43.18 76.2,27.94 76.68,27.46 TFT1.29
  Bottom 0.406: v76.2,47.62 v76.2,43.18
D10  (via drill 0.6)
  Top 0.191: IC1.68 44.17,58.14 45.56,59.53 62.39,59.53 64.14,57.78 64.14,50.96 70.17,44.93 74.77,44.93 v77.47,47.62 | v77.47,43.18 77.47,27.94 77.18,27.65 TFT1.30
  Bottom 0.406: v77.47,47.62 v77.47,43.18
D11  (via drill 0.6)
  Top 0.191: IC1.67 44.57,57.91 45.72,59.05 62.23,59.05 63.66,57.63 63.66,50.8 70.01,44.45 75.56,44.45 v78.74,47.62 | TFT1.31 77.68,27.52 78.74,28.57 v78.74,43.18
  Bottom 0.406: v78.74,47.62 v78.74,43.18
D12  (via drill 0.6)
  Top 0.191: IC1.63 58.97,52.79 60.96,50.8 60.96,44.45 63.5,41.91 64.77,41.91 v66.04,43.18 | v66.04,38.73 66.04,33.02 71.18,27.88 TFT1.18
  Bottom 0.406: v66.04,43.18 v66.04,38.73
D13  (via drill 0.6)
  Top 0.191: IC1.62 58.73,52.39 60.48,50.64 60.48,44.29 63.34,41.43 65.56,41.43 v67.31,43.18 | TFT1.19 71.68,28.02 67.31,32.38 v67.31,38.73
  Bottom 0.406: v67.31,43.18 v67.31,38.73
D14  (via drill 0.6)
  Top 0.191: IC1.61 58.5,51.99 60.01,50.48 60.01,44.13 63.18,40.96 66.36,40.96 v68.58,43.18 | v68.58,38.73 68.58,31.75 72.18,28.15 TFT1.20
  Bottom 0.406: v68.58,43.18 v68.58,38.73
D15  (via drill 0.6)
  Top 0.191: IC1.60 58.27,51.59 59.53,50.32 59.53,43.97 63.02,40.48 67.15,40.48 v69.85,43.18 | v69.85,38.73 69.85,31.11 72.68,28.29 TFT1.21
  Bottom 0.406: v69.85,43.18 v69.85,38.73
D16  (via drill 0.6)
  Top 0.191: IC1.59 58.03,51.19 59.05,50.16 59.05,43.81 62.87,40.01 67.94,40.01 v71.12,43.18 | v71.12,38.73 71.12,30.48 73.18,28.42 TFT1.22
  Bottom 0.406: v71.12,43.18 v71.12,38.73
D17  (via drill 0.6)
  Top 0.191: TFT1.23 73.68,23.83 v74.3,24.45 | IC1.35 49.85,41.59 52.07,39.37 55.24,39.37 60.96,33.66 60.96,31.75 65.09,27.62 v65.09,24.45
  Bottom 0.406: v74.3,24.45 v65.09,24.45
DCLK
  Top 0.191: IC1.45 55.38,45.59 64.77,36.2 64.77,33.02 69.85,27.94 69.85,25.08 69.18,24.41 TFT1.14
DTB
  Top 0.191: IC1.38 52.46,42.79 61.59,33.66 61.59,31.75 66.08,27.26 66.08,24.18 64.18,22.27 TFT1.4
GND  (via drill 0.6)
  Top 0.191: TFT1.13 68.68,12.92 | 68.68,12.92 68.9,12.7 69.53,12.7 69.68,12.85 TFT1.15 TFT1.16 TFT1.17 70.68,13.14 71.12,12.7 73.98,12.7 74.18,12.9 TFT1.24 TFT1.25 74.68,12.95 74.93,12.7 77.79,12.7 78.18,13.09 TFT1.32 TFT1.33 78.68,13.08 79.06,12.7 84.77,12.7 85.18,13.11 TFT1.46 85.18,19.14 92.07,26.03 C28.2 | 68.46,12.7 68.68,12.92 | 55.88,35.56 63.68,27.76 TFT1.3 63.68,12.88 63.18,12.38 | IC1.96 32.97,55.88 | 32.97,55.88 32.97,56.83 | 32.97,56.83 32.97,56.96 32.7,57.23 C24.1 | C25.1 29.53,56.83 30.48,55.88 32.97,55.88 | C26.1 C50.1 48.5,39.13 47.47,40.16 IC1.33 | IC1.94 33.77,56.72 33.66,56.83 32.97,56.83 | C23.1 47.3,56.83 45.77,55.29 IC1.65 | 49.53,50.01 49.15,50.39 IC1.57 | IC1.55 49.11,49.59 49.53,50.01 | C47.1 50.8,49.53 50.32,50.01 49.53,50.01 | IC1.109 28.45,48.39 28.1,48.74 C49.1 | IC1.2 33.37,40.35 33.58,40.56 | 33.58,40.56 33.66,40.64 | IC1.3 33.77,40.37 33.58,40.56 | IC1.17 39.37,40.16 39.05,40.48 | IC1.19 40.17,40.17 40.32,40.32 40.57,40.08 IC1.20 | IC1.125 29.29,41.99 28.57,41.27 C48.1 | 39.69,33.34 41.77,35.42 IC1.23
  Top 0.254: IC4.6 52.41,19.07 52.7,19.37
  Top 0.305: v88.27,31.11 88.27,29.84 87.63,29.21 88.27,28.57 C10.1
  Top 0.406: C21.1 C20.1 39.69,33.34 | R12.2 C14.2 89.53,67.63 89.22,67.31 IC3.2 87,67.31 86.36,67.94 86.36,72.39 | R13.2 R12.2 | C16.- R12.2 | 86.36,72.39 85.41,73.34 R11.2 83.19,76.2 81.92,77.47 | SOC_1.6 82.8,78.36 81.92,77.47 | 81.92,77.47 C15.1 | 86.36,72.39 90.68,76.71 SOC_1.15 90.68,87.63 | SOC_1.3 75.18,86.61 76.2,87.63 | 90.68,87.63 SOC_1.14 | 76.2,87.63 90.68,87.63 | SOC_1.13 63.5,88.9 64.77,87.63 | 64.77,87.63 76.2,87.63 | SOC_1.12 65.28,87.12 64.77,87.63 | C3.2 R2.2 | C2.- 50.87,89.85 C9.2 C4.2 47.69,91.76 C5.- IC2.2 46.99,93.98 46.35,94.61 43.81,94.61 43.18,93.98
  Top 0.508: C4.2 R3.2 C13.2 | C12.+ 53.91,80.47 D5.A 54.41,82.98 C11.2 | C5.- 46.61,91.06 45.72,90.17 43.18,90.17 41.91,88.9 41.91,86.36 | D3.C 41.1,85.55 41.91,86.36 | R2.2 43.18,85.09 41.91,86.36
  other vias: 92.08,31.11 64.14,26.04 71.12,63.5 73.66,60.96 76.2,58.42 83.82,78.74 93.98,67.31 82.55,76.2 71.12,92.71 82.55,87.63 85.09,92.71 30.48,60.96 40.64,66.04 33.02,63.5 38.1,63.5 46.99,39.05 36.83,48.26 41.91,48.26 41.91,44.45 36.83,44.45 39.37,45.72 39.37,46.99 60.96,54.61 63.5,45.72 63.5,48.26 46.35,57.78 41.27,33.66 42.55,33.66 76.2,68.58 80.01,68.58 78.74,67.31 44.13,89.85 41.91,87.63 73.66,87.63 27.94,38.1 19.68,36.2 31.75,15.24 35.56,15.24 48.26,11.43 46.99,12.7
  pour Top (isolate 0.191): 31.75,53.34 33.02,54.61 45.72,54.61 46.99,53.34 46.99,40.64 45.72,39.37 33.02,39.37 31.75,40.64
  pour Top (isolate 0.61): 0,100.33 100.33,100.33 100.33,0 0,0
  pour Bottom (isolate 0.61): 0,100.33 100.33,100.33 100.33,0 0,0
HS  (via drill 0.6)
  Top 0.191: IC1.44 55.14,45.19 64.14,36.2 64.14,33.02 68.9,28.26 v68.9,26.67 | v82.55,26.67 82.18,26.3 TFT1.40
  Bottom 0.406: v68.9,26.67 v82.55,26.67
LDEN  (via drill 0.6)
  Top 0.191: TFT1.42 83.18,21.9 v83.5,22.23 | v70.17,22.23 70.48,22.54 70.48,27.94 65.41,33.02 65.41,36.2 54.29,47.31 48.9,47.31 48.78,47.19 IC1.49
  Bottom 0.406: v83.5,22.23 v70.17,22.23
LED+
  Top 0.191: TFT1.49 86.68,17.54 86.92,17.54 87.18,17.54 TFT1.50
  Top 0.406: 86.92,17.54 86.92,18.18 94.61,25.88 94.61,53.98 93.98,54.61 93.98,58.42 91.44,60.96 C16.+ | IC3.5 85.72,67.31 86.36,66.67 86.36,66.04 87,65.41 D6.C
  Top 1.016: C16.+ 87.39,63.88 D6.C
LED-  (via drill 0.6)
  Top 0.191: TFT1.47 85.68,17.54 85.88,17.54 86.18,17.54 TFT1.48
  Top 0.406: 85.88,17.54 85.88,18.26 93.82,26.19 93.82,53.5 92.71,54.61 v92.71,57.15 | R13.1 R12.1 C14.1 88.58,70.8 v87.63,69.85 87.63,68.29 IC3.3
  Bottom 0.406: v87.63,69.85 91.44,66.04 91.44,60.96 92.71,59.69 v92.71,57.15
LED_A  (via drill 0.6)
  Top 0.406: J1.37 6.35,69.85 7.62,68.58 27.94,68.58 33.97,74.61 65.09,74.61 v65.41,74.93 | v74.3,74.93 79.38,74.93 80.01,74.3 R6.1
  Bottom 0.406: v65.41,74.93 v74.3,74.93
LR  (via drill 0.6)
  Top 0.191: TFT1.12 68.18,24.53 67.31,25.4 67.31,27.3 62.87,31.75 62.87,34.92 v57.15,40.64 | IC1.36 50.72,41.99 52.07,40.64 v53.34,40.64
  Bottom 0.406: v53.34,40.64 v57.15,40.64
N$1  (via drill 3.05)
  other vias: 3,3
N$2
  Top 0.508: IC2.1 45.55,93.31 D1.A | C8.2 37.78,89.08 L2.2
  Top 0.61: D1.A 43.17,91.9 41.04,89.77 40.97,89.71 | 40.97,89.71 40.96,89.69 | L2.2 40.97,89.71
N$3  (via drill 3.05)
  other vias: 97,3
N$4
  Top 0.191: IC1.24 42.17,36.57 45.4,33.34 R14.1
N$5  (via drill 3.05)
  other vias: 97,97
N$6  (via drill 3.05)
  other vias: 3,97
N$7
  Top 0.508: D2.C 41.77,79.69 D3.A 37.78,83.67 C8.1
N$8
  Top 0.508: D4.A 47.13,81.63 D2.A 49.27,79.69 C12.-
N$9
  Top 0.508: R4.2 R3.1 C4.1 48.28,93.66 IC2.3
N$11  (via drill 0.6)
  Top 0.406: IC3.1 88.58,66.36 88.9,66.04 v88.9,65.41
  Top 0.61: v88.9,60.18 D6.A
  Top 0.813: L1.2 84.78,57.96 D6.A
  Bottom 0.406: v88.9,60.18 v88.9,65.41
N$12
  Top 0.508: T1.1 53.34,84.78 52.7,84.14 C11.1 | C11.1 | D5.C 49.85,82.12 R5.1 50.16,83.19 C11.1
N$13
  Top 0.406: R7.2 R6.2 R11.1 83.19,70.48 82.55,69.85 R10.2 IC3.4
N$15
  Top 0.191: 35.88,28.32 Q4.2 | C21.2 35.88,32.7 37.47,34.29 39.37,34.29 41.37,36.29 IC1.22
  Top 0.406: C21.2 35.88,28.32
N$16
  Top 0.406: C20.2 R14.2 43.5,30.22 Q4.1
N$24
  Top 0.191: IC1.128 30.87,40.4 30.48,40.01 R9.1
N$28  (via drill 0.6)
  Top 0.191: TFT1.7 65.68,19.96 66.67,20.95 v66.67,23.5 | v86.36,23.5 R8.1
  Top 0.406: C10.2 R8.1
  Bottom 0.406: v66.67,23.5 v86.36,23.5
PWM  (via drill 0.6)
  Top 0.191: IC1.51 49.8,47.99 50.01,47.78 54.13,47.78 54.61,48.26 54.93,48.26
  Top 0.406: v57.15,48.26 54.93,48.26 | R7.1 73.34,73.34 v66.04,66.04
  Bottom 0.406: v66.04,66.04 57.15,57.15 v57.15,48.26
SD_CLK  (via drill 0.6)
  Top 0.406: J1.32 v15.24,62.23 | v20.32,62.23 25.4,62.23 34.92,71.75 66.67,71.75 73.03,78.11 74.93,78.11 76.2,79.38 76.2,82.23 76.83,82.87 79.69,82.87 80.26,82.3 SOC_1.5
  Bottom 0.406: v15.24,62.23 v20.32,62.23
SD_CS
  Top 0.406: J1.36 27.94,67.31 34.29,73.66 66.04,73.66 70.1,77.72 SOC_1.1
SD_DIN
  Top 0.406: J1.34 26.67,64.77 34.61,72.71 66.36,72.71 72.64,78.99 SOC_1.2
SD_DO  (via drill 0.6)
  Top 0.406: J1.30 v17.78,59.69 | v22.86,59.69 24.13,59.69 35.24,70.8 66.99,70.8 73.34,77.15 75.25,77.15 76.83,78.74 76.83,81.92 77.15,82.23 78.74,82.23 79.06,81.92 79.06,79.69 79.69,79.06 80.64,79.06 81.28,79.69 81.28,81.6 81.92,82.23 84.77,82.23 85.34,81.66 SOC_1.7
  Bottom 0.406: v17.78,59.69 v22.86,59.69
T_CLK  (via drill 0.6)
  Top 0.254: IC4.16 48.21,23.29 47.78,22.86 46.99,22.86
  Top 0.406: v44.45,22.86 46.99,22.86
  Top 0.61: J1.18 v13.18,44.45
  Bottom 0.406: v13.18,44.45 13.18,31.27 21.59,22.86 v44.45,22.86
T_CS  (via drill 0.6)
  Top 0.254: IC4.15 49.81,24.33 49.37,24.77 48.74,24.77 48.1,24.13 46.99,24.13
  Top 0.406: v44.29,24.13 46.99,24.13
  Top 0.61: J1.20 v14.45,46.99
  Bottom 0.406: v14.45,46.99 14.45,31.75 22.07,24.13 v44.29,24.13
T_DIN  (via drill 0.6)
  Top 0.254: IC4.14 50.46,24.47 49.53,25.4
  Top 0.406: J1.22 v21.59,49.53 | v45.72,25.4 49.53,25.4
  Bottom 0.406: v21.59,49.53 21.59,27.94 24.13,25.4 v45.72,25.4
T_DO  (via drill 0.6)
  Top 0.254: v51.75,25.4 IC4.12
  Top 0.406: J1.26 v13.02,54.61
  Bottom 0.406: v51.75,25.4 49.53,25.4 45.72,21.59 20.32,21.59 11.43,30.48 11.43,44.45 13.02,46.04 v13.02,54.61
T_IRQ  (via drill 0.6)
  Top 0.254: IC4.11 52.41,22.25 51.43,21.27 R1.2
  Top 0.406: R1.2 45.4,21.27 v44.45,20.32 | v13.97,57.15 J1.28
  Bottom 0.406: v44.45,20.32 19.05,20.32 8.89,30.48 8.89,55.7 J1.28 v13.97,57.15
TFT_0  (via drill 0.6)
  Top 0.191: IC1.7 35.37,36.64 34.45,35.72 27.15,35.72 v25.4,34.13
  Top 0.406: J1.2 19.05,24.13 23.97,29.05 v25.4,29.05
  Bottom 0.406: v25.4,34.13 v25.4,29.05
TFT_1  (via drill 0.6)
  Top 0.191: IC1.8 35.77,36.41 34.61,35.24 27.78,35.24 v26.67,34.13
  Top 0.406: J1.4 20.32,26.67 23.65,30 v26.67,30
  Bottom 0.406: v26.67,34.13 v26.67,30
TFT_2  (via drill 0.6)
  Top 0.191: IC1.9 36.17,36.17 34.77,34.77 28.57,34.77 v27.94,34.13 28.1,34.29
  Top 0.406: v27.94,30.96 23.34,30.96 21.59,29.21 J1.6 10.16,29.21
  Bottom 0.406: v27.94,34.13 v27.94,30.96
TFT_3  (via drill 0.6)
  Top 0.191: IC1.10 36.57,35.94 34.45,33.81 v29.21,33.81
  Top 0.406: J1.8 24.13,31.75 24.29,31.91 v29.21,31.91
  Bottom 0.406: v29.21,33.81 v29.21,31.91
TFT_4
  Top 0.191: IC1.11 36.97,35.54 34.29,32.86
  Top 0.406: J1.10 22.86,34.29 24.29,32.86 34.29,32.86
TFT_5  (via drill 0.6)
  Top 0.191: IC1.116 29.71,45.59 28.57,44.45 24.29,44.45 23.81,43.97 23.5,43.97
  Top 0.406: J1.12 13.97,36.83 17.14,40.01 v18.41,40.01 | v18.41,42.23 19.37,43.18 21.59,43.18 22.38,43.97 23.5,43.97
  Bottom 0.406: v18.41,42.23 v18.41,40.01
TFT_6
  Top 0.191: IC1.115 29.48,45.99 28.42,44.93 24.13,44.93 23.81,44.61 23.5,44.61
  Top 0.406: J1.14 13.97,39.37 18.41,43.81 21.27,43.81 22.07,44.61 23.5,44.61
TFT_7  (via drill 0.6)
  Top 0.191: IC1.114 29.25,46.39 28.26,45.4 23.97,45.4 23.81,45.24 23.5,45.24
  Top 0.406: J1.16 13.81,41.91 v16.67,44.77 | v19.68,44.77 21.27,44.77 21.75,45.24 23.5,45.24
  Bottom 0.406: v16.67,44.77 v19.68,44.77
TFT_8
  Top 0.191: IC1.113 29.01,46.79 28.1,45.88 24.92,45.88
  Top 0.406: J1.13 6.35,39.37 7.62,40.64 13.97,40.64 19.21,45.88 24.92,45.88
TFT_9
  Top 0.191: IC1.112 28.77,47.19 27.94,46.35 25.4,46.35 25.24,46.51 24.92,46.51
  Top 0.406: J1.15 6.35,41.91 7.62,43.18 13.65,43.18 16.99,46.51 24.92,46.51
TFT_10
  Top 0.191: IC1.111 28.54,47.59 27.78,46.83 25.56,46.83 25.24,47.15 24.92,47.15
  Top 0.406: J1.17 6.35,44.45 7.62,45.72 14.92,45.72 16.35,47.15 24.92,47.15
TFT_11
  Top 0.191: IC1.107 28.6,49.19 27.62,50.16 27.3,50.16
  Top 0.406: J1.19 6.35,46.99 7.62,48.26 22.23,48.26 24.13,50.16 27.3,50.16
TFT_12
  Top 0.191: IC1.106 28.83,49.59 27.62,50.8 27.3,50.8
  Top 0.406: J1.21 6.35,49.53 7.62,50.8 27.3,50.8
TFT_13
  Top 0.191: IC1.105 29.07,49.99 27.62,51.44 27.3,51.44
  Top 0.406: J1.23 6.35,52.07 7.62,53.34 21.59,53.34 23.5,51.44 27.3,51.44
TFT_14
  Top 0.191: IC1.104 29.3,50.39 27.62,52.07 27.3,52.07
  Top 0.406: J1.25 6.35,54.61 7.62,55.88 20.32,55.88 24.13,52.07 27.3,52.07
TFT_15
  Top 0.191: IC1.103 29.54,50.79 27.62,52.7 27.3,52.7
  Top 0.406: J1.27 6.35,57.15 7.62,58.42 19.05,58.42 24.77,52.7 27.3,52.7
TFT_CS  (via drill 0.6)
  Top 0.191: IC1.123 25.49,42.79 23.97,41.27
  Top 0.406: J1.29 6.35,59.69 7.62,60.96 18.1,60.96 v23.18,55.88 | v23.18,40.48 23.97,41.27
  Bottom 0.406: v23.18,55.88 v23.18,40.48
TFT_RD
  Top 0.191: IC1.121 24.7,43.59 23.81,42.7 23.5,42.7
  Top 0.406: J1.11 6.35,36.83 7.62,38.1 13.97,38.1 17.14,41.27 21.59,41.27 23.02,42.7 23.5,42.7
TFT_REST  (via drill 0.6)
  Top 0.191: IC1.127 29.6,41.19 27.78,39.37 27.46,39.37
  Top 0.406: J1.33 6.99,64.77 8.26,63.5 17.14,63.5 v24.77,55.88 | v24.77,39.37 27.46,39.37
  Bottom 0.406: v24.77,55.88 v24.77,39.37
TFT_RS  (via drill 0.6)
  Top 0.191: IC1.122 24.93,43.19 23.81,42.07 23.5,42.07
  Top 0.406: J1.7 6.35,31.75 7.62,33.02 v16.51,33.02 | v16.51,35.56 16.51,36.83 17.78,38.1 19.37,38.1 23.34,42.07 23.5,42.07
  Bottom 0.406: v16.51,33.02 v16.51,35.56
TFT_WR  (via drill 0.6)
  Top 0.191: IC1.120 24.46,43.99 23.81,43.34 23.5,43.34
  Top 0.406: J1.9 6.35,34.29 7.62,35.56 13.97,35.56 17.14,38.73 18.57,38.73 v19.84,40.01 | v19.84,42.23 21.59,42.23 22.7,43.34 23.5,43.34
  Bottom 0.406: v19.84,40.01 v19.84,42.23
UD  (via drill 0.6)
  Top 0.191: TFT1.11 67.68,24.39 66.67,25.4 66.67,27.3 62.23,31.75 62.23,34.29 v54.61,41.91 | IC1.37 51.59,42.39 v52.07,41.91
  Bottom 0.406: v52.07,41.91 v54.61,41.91
VCC/2  (via drill 0.6)
  Top 0.191: C24.2 34.6,57.15 34.17,56.71 IC1.93 34.17,53.62 35.08,52.7 v35.56,52.7 | IC1.1 32.97,41.17 | C50.2 45.8,37.15 45.37,37.58 IC1.32 45.37,40.99 v44.61,41.91 | v34.29,48.26 34.02,47.99 IC1.110 28.3,47.99 27.62,47.31 25.72,47.31 25.24,47.78 C49.2 | IC1.102 33.74,51.19 v34.29,50.64 | IC1.73 42.17,52.76 v42.23,52.7 | C23.2 48.26,54.13 47.47,53.34 IC1.64 46.13,53.19 45.56,52.63 45.56,52.07 44.93,51.44 v44.61,51.44 | IC1.82 38.57,53.02 v38.58,52.7 | IC1.56 44.91,49.99 v44.61,49.53 | IC1.40 44.99,43.59 v44.61,43.97 | IC1.126 32.55,41.59 32.97,41.17 | IC1.119 32.96,44.39 33.42,44.85 v34.29,44.85 | IC1.46 45.67,45.99 45.56,45.88 v44.61,45.88 | v39.45,41.91 39.45,40.88 39.77,40.56 IC1.18 | v41.12,41.91 41.12,40.8 40.97,40.65 IC1.21 | v42.86,41.91 42.86,40.96 42.57,40.66 IC1.25 | v37.7,41.91 37.7,41.2 38.17,40.73 IC1.14 | v36.04,41.12 34.97,40.05 IC1.6 | 32.97,41.17 33.55,41.17 v34.92,42.55
  Top 0.61: REG2.2 23.81,81.59 C22.2 23.81,77.79 v25.4,76.2
  Bottom 0.406: 36.04,41.91 35.56,41.91
  Bottom 0.813: v34.29,44.85 v34.29,48.26 v34.29,50.64 | v25.4,76.2 35.56,66.04 v35.56,52.7
  Bottom 1.016: v35.56,52.7 v38.58,52.7 v42.23,52.7 43.34,52.7 v44.61,51.44 v44.61,49.53 v44.61,45.88 v44.61,43.97 v44.61,41.91 v42.86,41.91 v41.12,41.91 v39.45,41.91 v37.7,41.91 36.04,41.91 v36.04,41.12 | 35.56,41.91 v34.92,42.55 34.29,43.18 v34.29,44.85
VCOM  (via drill 0.6)
  Top 0.191: TFT1.5 64.68,20.23 v65.41,20.95 | TFT1.45 84.68,20.55 v85.09,20.95 86.28,20.95 90.17,24.85 C28.1
  Top 0.508: R27.1 R28.2 C28.1
  Bottom 0.406: v65.41,20.95 v85.09,20.95
VS  (via drill 0.6)
  Top 0.191: IC1.43 54.91,44.79 63.5,36.2 63.5,33.02 67.94,28.57 67.94,26.04 v68.58,25.4 | TFT1.41 82.68,24.89 v83.19,25.4
  Bottom 0.406: v68.58,25.4 v83.19,25.4
X+  (via drill 0.6)
  Top 0.254: FC-4P_2.10 15.47,15.47 15.88,15.88 24.77,15.88 25.17,15.47 FC-4P_1.7 25.17,12.63 v24.92,12.38 | IC4.2 49.81,15.52 49.53,15.24 43.34,15.24 42.7,15.88 40.32,15.88 39.87,15.42 FC-4P_3.9 39.87,12.88 v39.37,12.38
  Bottom 0.406: v39.37,12.38 v24.92,12.38
X-  (via drill 0.6)
  Top 0.254: FC-4P_2.8 13.47,16.17 14.45,17.14 26.19,17.14 27.17,16.17 FC-4P_1.9 27.17,10.77 v27.46,10.48 | FC-4P_3.7 37.87,11.52 | 37.87,11.52 v36.83,10.48 | IC4.4 51.11,9.68 49.85,8.41 40.97,8.41 37.87,11.52
  Bottom 0.406: v27.46,10.48 v36.83,10.48
Y+  (via drill 0.6)
  Top 0.254: FC-4P_2.9 14.47,15.74 15.24,16.51 25.4,16.51 26.17,15.74 FC-4P_1.8 26.17,11.45 v26.19,11.43 | IC4.3 50.46,9.82 49.53,8.89 41.91,8.89 40.64,10.16 v40.64,11.43 40.87,11.66 FC-4P_3.10
  Bottom 0.406: v26.19,11.43 v40.64,11.43
Y-
  Top 0.254: FC-4P_2.7 12.47,16.28 13.97,17.78 26.67,17.78 28.17,16.28 | 28.17,16.28 FC-4P_1.10 28.17,11.43 30.71,8.89 39.37,8.89 40.32,7.94 50.16,7.94 51.76,9.53 IC4.5 | FC-4P_3.8 38.87,17.01 38.1,17.78 29.67,17.78 28.17,16.28

### Text on the board
tPlace: TFT Driver V1.0 | PWM | LED_A | On